# EAGLE design slide-control-attiny85 (EAGLE 9.6.2)
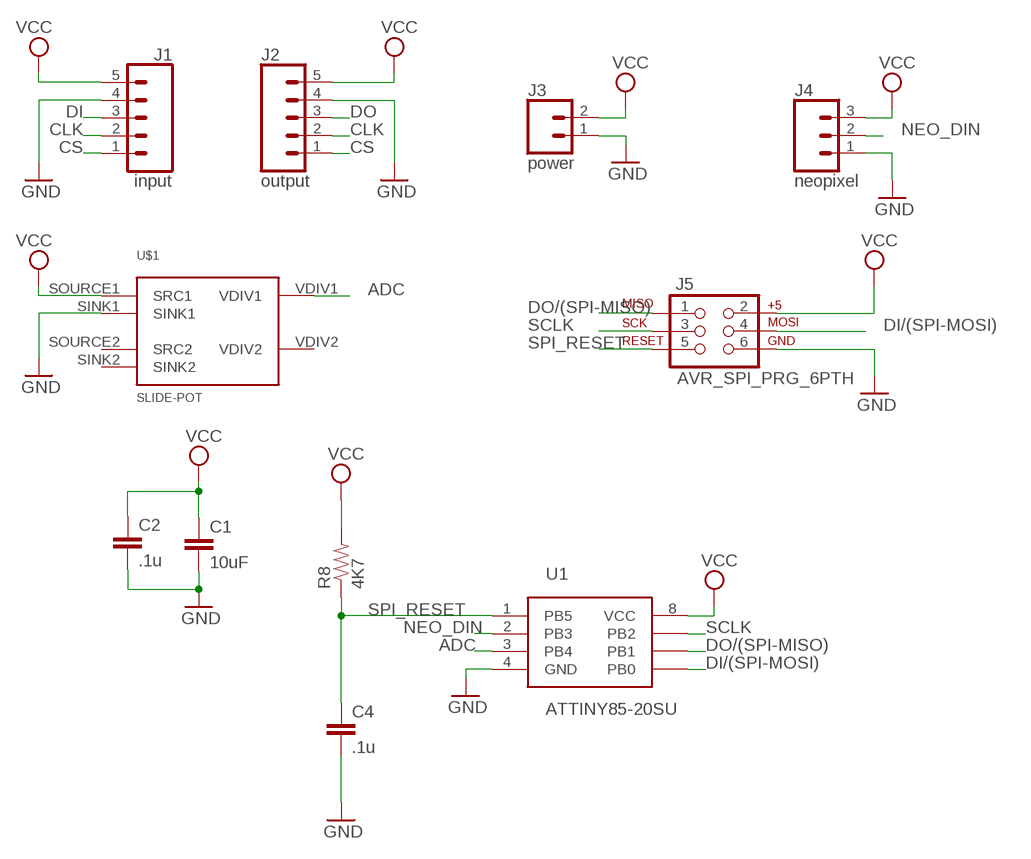
[diagram p0: schematic, sheet 1]

## Parts
C1  10uF  10UF-1206-6.3V-20%  [1206]
C2  .1u  CAP0805  [0805]
C4  .1u  CAP0805  [0805]
J1  input  CONN_05  [1X05]
J2  output  CONN_05  [1X05]
J3  power  CONN_02  [1X02]
J4  neopixel  CONN_03  [1X03]
J5  AVR_SPI_PRG_6PTH  [2X3]
R8  4K7  RESISTOR  [0805]
U1  ATTINY85-20SU  [SOIC-8]
U$1  SLIDE-POT  [SLIDE-POT]

## Nets
ADC: U1.3(PB4) U$1.VDIV1
CLK: J1.2 J2.2
CS: J1.1 J2.1
DI: J1.3
DI/(SPI-MOSI): J5.4 U1.5(PB0)
DO: J2.3
DO/(SPI-MISO): J5.1 U1.6(PB1)
GND: C1.2 C2.2 C4.2 J1.4 J2.4 J3.1 J4.1 J5.6 U1.4(GND) U$1.SINK1
NEO_DIN: J4.2 U1.2(PB3)
SCLK: J5.3 U1.7(PB2)
SPI_RESET: C4.1 J5.5 R8.1 U1.1(PB5)
VCC: C1.1 C2.1 J1.5 J2.5 J3.2 J4.3 J5.2 R8.2 U1.8(VCC) U$1.SOURCE1(SRC1)
Unconnected: U$1.SINK2 U$1.SOURCE2(SRC2) U$1.VDIV2

## Library data of the parts
C1 = SparkFun-Capacitors:10UF: 10.0µF ceramic capacitors A capacitor is a passive two-terminal electrical component used to store electrical energy temporarily in an electric field.; PROD_ID: CAP-10057
C2 C4 = SparkFun:CAP: Capacitor Standard 0603 ceramic capacitor, and 0.1" leaded capacitor.
J1 J2 = SparkFun-Connectors:CONN_05: Multi connection point. Often used as Generic Header-pin footprint for 0.1 inch spaced/style header connections On any of the 0.1 inch spaced packages, you can populate with these: Break Away Headers - Straight <https://www.sparkfun.com/products/116> (PRT-00116) Break Away Male Headers - Right Angle <https://www.sparkfun.com/products/553> (PRT-00553) Female Headers <https://www.sparkfun.com/products/115> (PRT-00115) Break Away Headers - Machine Pin <https://www.sparkfun.com/products/117> (PRT-00117) Break Away Female Headers - Swiss Machine Pin <https://www.sparkfun.com/products/743> (PRT-00743) For SCREWTERMINALS and SPRING TERMINALS visit here: Screw Terimnals on SparkFun.com <https://www.sparkfun.com/search/results?term=Screw+Terminals> (5mm/3.5mm/2.54mm spacing) This device is also useful as a general connection point to wire up your design to another part of your project. Our various solder wires solder well into these plated through hole pads. Hook-Up Wire - Assortment (Stranded, 22 AWG) <https://www.sparkfun.com/products/11375> (PRT-11375) Hook-Up Wire - Assortment (Solid Core, 22 AWG) <https://www.sparkfun.com/products/11367> (PRT-11367) View the entire wire category on our website here <https://www.sparkfun.com/categories/141> Special notes: Molex polarized connector foot print use with SKU : PRT-08231 with associated crimp pins and housings. 1MM SMD Version SKU: PRT-10208
J3 = SparkFun-Connectors:CONN_02: Multi connection point. Often used as Generic Header-pin footprint for 0.1 inch spaced/style header connections On any of the 0.1 inch spaced packages, you can populate with these: Break Away Headers - Straight <https://www.sparkfun.com/products/116> (PRT-00116) Break Away Male Headers - Right Angle <https://www.sparkfun.com/products/553> (PRT-00553) Female Headers <https://www.sparkfun.com/products/115> (PRT-00115) Break Away Headers - Machine Pin <https://www.sparkfun.com/products/117> (PRT-00117) Break Away Female Headers - Swiss Machine Pin <https://www.sparkfun.com/products/743> (PRT-00743) For SCREWTERMINALS and SPRING TERMINALS visit here: Screw Terimnals on SparkFun.com <https://www.sparkfun.com/search/results?term=Screw+Terminals> (5mm/3.5mm/2.54mm spacing) This device is also useful as a general connection point to wire up your design to another part of your project. Our various solder wires solder well into these plated through hole pads. Hook-Up Wire - Assortment (Stranded, 22 AWG) <https://www.sparkfun.com/products/11375> (PRT-11375) Hook-Up Wire - Assortment (Solid Core, 22 AWG) <https://www.sparkfun.com/products/11367> (PRT-11367) View the entire wire category on our website here <https://www.sparkfun.com/categories/141> Special notes: Molex polarized connector foot print use with: PRT-08233 with associated crimp pins and housings. 2.54_SCREWTERM for use with PRT-10571. 3.5mm Screw Terminal footprints for PRT-08084 5mm Screw Terminal footprints for use with PRT-08432
J4 = SparkFun-Connectors:CONN_03: Multi connection point. Often used as Generic Header-pin footprint for 0.1 inch spaced/style header connections On any of the 0.1 inch spaced packages, you can populate with these: Break Away Headers - Straight <https://www.sparkfun.com/products/116> (PRT-00116) Break Away Male Headers - Right Angle <https://www.sparkfun.com/products/553> (PRT-00553) Female Headers <https://www.sparkfun.com/products/115> (PRT-00115) Break Away Headers - Machine Pin <https://www.sparkfun.com/products/117> (PRT-00117) Break Away Female Headers - Swiss Machine Pin <https://www.sparkfun.com/products/743> (PRT-00743) Stackable Header - 3 Pin (Female, 0.1") <https://www.sparkfun.com/products/13875> (PRT-13875) For SCREWTERMINALS and SPRING TERMINALS visit here: Screw Terimnals on SparkFun.com <https://www.sparkfun.com/search/results?term=Screw+Terminals> (5mm/3.5mm/2.54mm spacing) This device is also useful as a general connection point to wire up your design to another part of your project. Our various solder wires solder well into these plated through hole pads. Hook-Up Wire - Assortment (Stranded, 22 AWG) <https://www.sparkfun.com/products/11375> (PRT-11375) Hook-Up Wire - Assortment (Solid Core, 22 AWG) <https://www.sparkfun.com/products/11367> (PRT-11367) View the entire wire category on our website here <https://www.sparkfun.com/categories/141> Special notes: Molex polarized connector foot print use with SKU : PRT-08232 with associated crimp pins and housings.
J5 = SparkFun-Connectors:AVR_SPI_PRG_6: AVR ISP 6 Pin This is the reduced ISP connector for AVR programming. Common on Arduino. This footprint will take up less PCB space and can be used with a 10-pin to 6-pin adapter such as SKU: BOB-08508
R8 = SparkFun:RESISTOR: Resistor Basic schematic elements and footprints for 0603, 1206, and PTH 1/10th watt (small) resistors.
U1 = Microcontroller:ATTINY85-20SU: IC MCU 8BIT 8KB FLASH 8SOIC Manufacturer's datasheet <http://ww1.microchip.com/downloads/en/DeviceDoc/Atmel-2586-AVR-8-bit-Microcontroller-ATtiny25-ATtiny45-ATtiny85_Datasheet-Summary.pdf>; CREATED_BY: PCBLayout.com; DIGI_KEY_PART_NUMBER: ATTINY85-20SU-ND; MANUFACTURER: Microchip Technology; MPN: ATTINY85-20SU; PACKAGE: 8-SOIC
U$1 = GARTH:SLIDE-POT

## Board
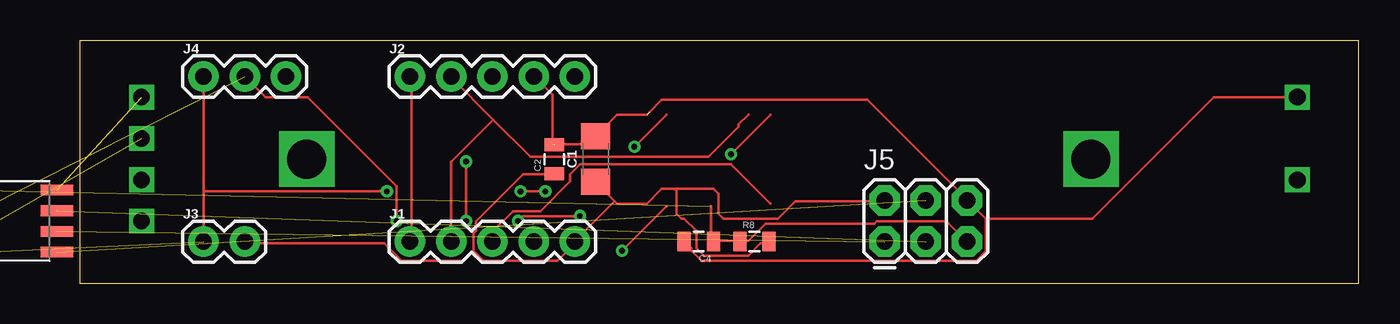
[diagram p1: board, top side]
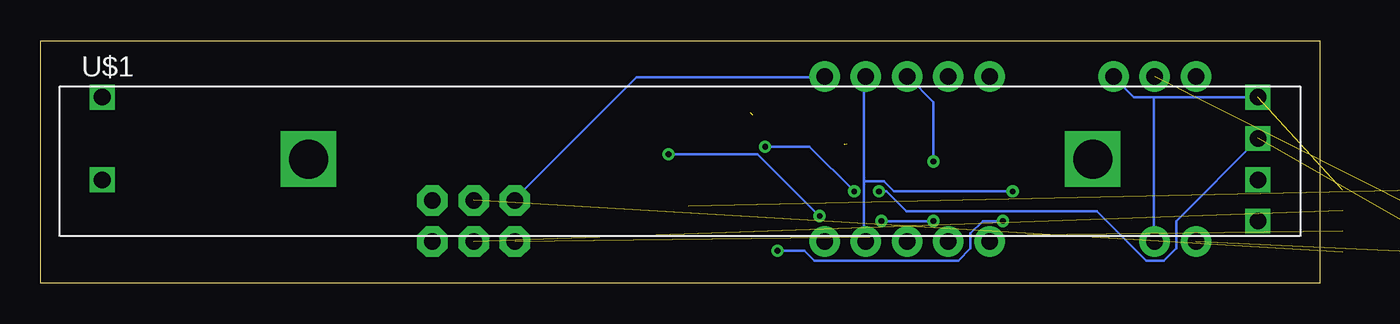
[diagram p2: board, bottom side, seen from below]

Size 78.72 x 14.91 mm. Coordinates in mm from the lower left corner, seen from the top.
Outline: 0,0 78.72,0 78.72,14.91 0,14.91 0,0
Copper layers (1*16): Top 0.035mm / dielectric 1.5mm / Bottom 0.035mm
Design rules "default": minimum track width 6mil, minimum drill 0.35mm, track to track 6mil, track to pad 6mil, pad to pad 6mil, via to via 6mil, smd to smd 6mil, copper to edge 40mil, drill to drill 6mil, minimum pad ring 10mil, minimum via ring 8mil, stop-mask expansion 4mil, vias tented up to drill 0mil, thermal gap 10mil

### Footprints (pad centres in the part's own frame; a part is rotated, then mirrored left to right if it is on the bottom)
1206 = smd 1.6 x 1.8: 1 -1.4,0; 2 1.4,0
0805 = smd 0.8 x 1.2: 1 -0.9,0; 2 0.9,0
1X05 = drill 1.016 pad 1.88: 1 0,0; 2 2.54,0; 3 5.08,0; 4 7.62,0; 5 10.16,0
1X02 = drill 1.016 pad 1.88: 1 0,0; 2 2.54,0
1X03 = drill 1.016 pad 1.88: 1 0,0; 2 2.54,0; 3 5.08,0
2X3 = drill 1.016 pad 1.88 octagon: 1 0,0; 2 0,2.54; 3 2.54,0; 4 2.54,2.54; 5 5.08,0; 6 5.08,2.54
SOIC-8 = smd 2 x 0.66: 1 -2.405,1.905; 2 -2.405,0.635; 3 -2.405,-0.635; 4 -2.405,-1.905; 5 2.405,-1.905; 6 2.405,-0.635; 7 2.405,0.635; 8 2.405,1.905
SLIDE-POT = drill 2.4 square: P$7 12.7,-3.81; P$8 60.96,-3.81 | drill 1.016 square: SINK1 0,0; SINK2 0,-5.08; SOURCE1 71.12,0; SOURCE2 71.12,-5.08; VDIV1 71.12,-2.54; VDIV2 71.12,-7.62

### Placement (x,y rotation side)
C1  31.75,7.62 90 top
C2  29.21,7.62 90 top
C4  38.1,2.54 180 top
J1  20.32,2.54 0 top
J2  20.32,12.7 0 top
J3  7.62,2.54 0 top
J4  7.62,12.7 0 top
J5  49.53,2.54 0 top
R8  41.53,2.54 0 top
U1  -3.81,3.81 0 top
U$1  74.93,11.43 0 bottom

### Tracks (layer width: path | path; a pad name or v marks a point on that pad's centre or on a via)
ADC  (via drill 0.35)  (1 unrouted)
  Top 0.152: v34.14,8.38 36.12,10.36 | v27.13,5.64 v28.65,5.64
  Bottom 0.152: v34.14,8.38 31.39,8.38 v28.65,5.64 | v27.13,5.64 26.67,5.64 25.45,4.42 13.72,4.42 10.67,1.37 9.6,1.37 8.84,2.13 8.84,3.81 3.81,8.84 U$1.VDIV1
CLK
  Top 0.152: 41.15,10.36 40.54,9.75 40.54,9.6 38.71,7.77 27.74,7.77 25.45,10.06 | 25.45,10.06 22.86,12.65 J2.2 | J1.2 22.86,7.47 25.45,10.06
CS
  Top 0.152: J1.1 20.42,2.59 20.42,12.65 J2.1
DI
  Top 0.152: 42.52,4.88 40.08,7.32 30.79,7.32 30.18,6.71 30.18,6.25 28.35,4.42 26.67,4.42 25.45,3.2 25.45,2.59 J1.3
DI/(SPI-MOSI)  (1 unrouted)
DO  (via drill 0.35)
  Top 0.152: v40.08,7.92 42.52,10.36 | v30.79,4.12 27.28,4.12 v26.98,3.81 | v23.77,7.47 v23.77,3.81
  Bottom 0.152: v40.08,7.92 34.59,7.92 v30.79,4.12 | v23.77,3.81 v26.98,3.81 | v23.77,7.47 23.77,11.12 25.3,12.65 J2.3
DO/(SPI-MISO)  (1 unrouted)
GND  (via drill 0.35)  (4 unrouted)
  Top 0.152: J4.1 7.62,5.64 | 7.62,5.64 J3.1 | 29.26,8.53 31.24,8.53 31.7,8.99 C1.2 31.85,9.14 33.07,10.36 34.9,10.36 | 29.11,8.53 29.11,11.58 28.04,12.65 J2.4 | v18.9,5.64 7.62,5.64 | 55.78,3.96 55.78,1.98 55.17,1.37 38.25,1.37 37.64,1.98 37.64,2.13 37.34,2.44 C4.2 | 55.78,3.96 54.71,5.03 J5.6 54.56,5.18 48.46,11.28 35.81,11.28 35.05,10.52 | U$1.SINK1 69.8,11.43 62.33,3.96 55.78,3.96
  Bottom 0.152: 28.04,6.25 28.04,12.65 J2.4 | 28.04,6.25 28.04,2.59 J1.4 | v18.9,5.64 26.21,5.64 26.82,6.25 28.04,6.25
NEO_DIN  (via drill 0.35)  (1 unrouted)
  Top 0.152: v33.38,1.98 36.12,4.72 | v19.51,3.81 19.51,5.94 14.02,11.43 11.43,11.43 J4.2
  Bottom 0.152: v33.38,1.98 31.7,1.98 31.09,1.37 22.25,1.37 21.49,2.13 21.49,3.05 20.73,3.81 v19.51,3.81
SCLK  (1 unrouted)
SPI_RESET  (1 unrouted)
  Top 0.152: 38.86,4.72 38.86,2.59 C4.1 39.01,2.59 40.54,2.59 R8.1 40.69,2.59 41.15,2.59 42.22,3.66 48.92,3.66 49.07,3.81 53.34,3.81 J5.5
VCC  (1 unrouted)
  Top 0.152: 24.23,1.98 24.23,3.05 24.38,3.2 24.38,3.81 27.28,6.71 29.11,6.71 C2.1 | 24.23,1.98 24.84,1.37 29.41,1.37 30.48,2.44 J1.5 30.48,2.59 32.92,5.03 | 32.92,5.03 31.85,6.1 C1.1 | 32.92,5.03 33.07,4.88 34.9,4.88 35.81,5.79 36.58,5.79 | 36.58,5.79 36.73,5.64 36.73,4.27 37.03,3.96 37.19,3.96 37.95,3.2 37.95,2.13 38.41,1.68 41.15,1.68 41.91,2.44 42.37,2.44 R8.2 | 36.58,5.79 39.01,5.79 39.32,5.49 39.32,4.27 39.62,3.96 42.98,3.96 44.04,5.03 49.53,5.03 J5.2 | 24.23,1.98 23.62,1.37 19.81,1.37 18.75,2.44 10.21,2.44 J3.2
  Bottom 0.152: 10.21,11.43 11.43,11.43 J4.3 | 10.21,11.43 U$1.SOURCE1 | 10.21,11.43 10.21,2.59 J3.2 | J2.5 30.48,12.65 42.06,12.65 49.53,5.18 J5.2